# Altium schematic sheet Sheet1.SchDoc
size 431 x 279 mm; SheetNumber: 2; SheetTotal: 7; ENG_APP_DATE: --/--/--; DSN_APP_DATE: --/--/--; CHK_APP_DATE: --/--/--
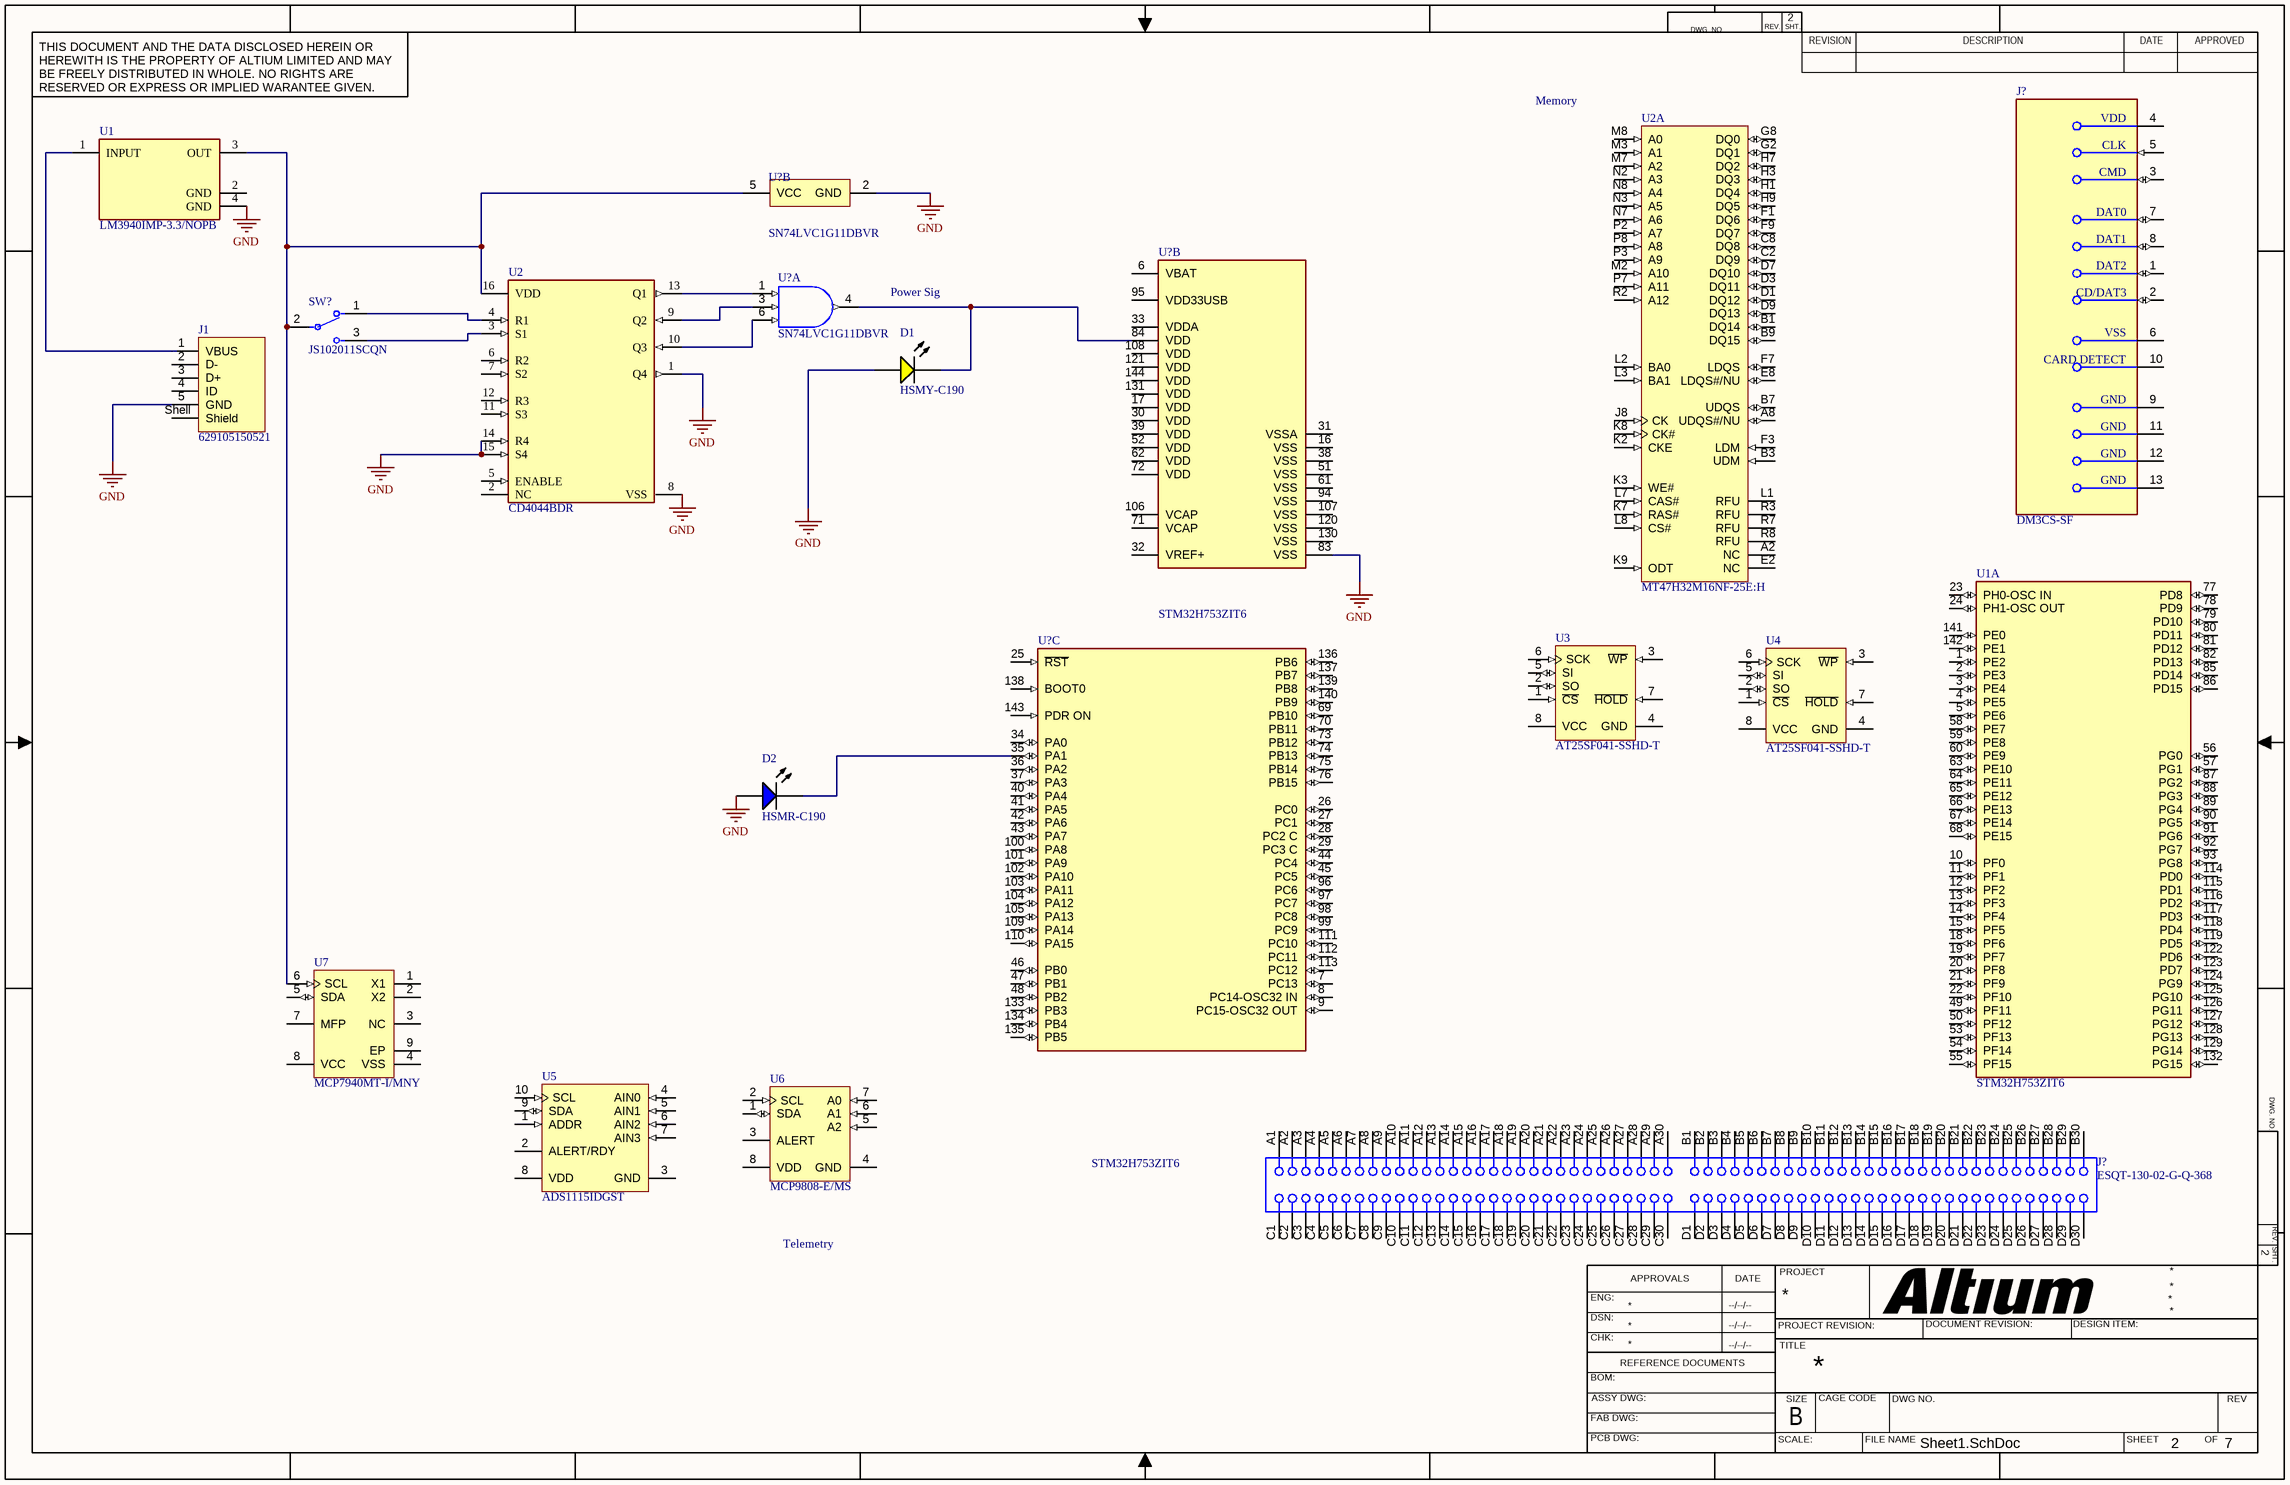
[diagram p0: Sheet1.SchDoc]

## Parts
(Parts that share a designator on the sheet are numbered #1, #2 ... from top to bottom, then left to right.)
D1  HSMY-C190  [AVAG-HSMX-C190_V]
D2  HSMR-C190  [AVAG-HSMX-C190_V]
J1  629105150521  [629105150521]
J?#1  DM3CS-SF  [FP-DM3CS-SF-MFG]
J?#2  ESQT-130-02-G-Q-368  [BTB2-V120F-04]
SW?  JS102011SCQN  [FP-JS102011SCQN-MFG]
U1#1  LM3940IMP-3.3/NOPB  [FP-DCY0004A-MFG]
U1#2  STM32H753ZIT6  [FP-LQFP144-1A-MFG]  (part A of 3)
U2#1  MT47H32M16NF-25E:H  [MICT-NF-84]  (part A of 2)
U2#2  CD4044BDR  [FP-D0016A-IPC_C]
U3  AT25SF041-SSHD-T  [ADST-SOIC-8_L]
U4  AT25SF041-SSHD-T  [ADST-SOIC-8_L]
U5  ADS1115IDGST  [TI-DGS10_M]
U6  MCP9808-E/MS  [MCHP-MSOP-MS8_L]
U7  MCP7940MT-I/MNY  [MCHP-TDFN-MNY8_V]
U?#1  SN74LVC1G11DBVR  [DBV0006A_N]  (part B of 2)
U?#2  STM32H753ZIT6  [FP-LQFP144-1A-MFG]  (part B of 3)
U?#3  SN74LVC1G11DBVR  [DBV0006A_N]  (part A of 2)
U?#4  STM32H753ZIT6  [FP-LQFP144-1A-MFG]  (part C of 3)

## Nets
GND: D1.1(A) D2.1(A) J1.5(GND) U1#1.4(GND) U2#2.1(Q4) U2#2.8(VSS) U2#2.14(R4) U2#2.15(S4) U?#1.2(GND) U?#2.83(VSS)
NetD1_2: D1.2(K) U?#2.84(VDD) U?#3.4(Y)
NetD2_2: D2.2(K) U?#4.35(PA1)
NetJ1_1: J1.1(VBUS) U1#1.1(INPUT)
NetSW?_1: SW?.1 U2#2.4(R1)
NetSW?_2: SW?.2(C) U1#1.3(OUT) U2#2.16(VDD) U7.6(SCL) U?#1.5(VCC)
NetSW?_3: SW?.3 U2#2.3(S1)
NetU2#2_9: U2#2.9(Q2) U?#3.3(B)
NetU2#2_10: U2#2.10(Q3) U?#3.6(C)
NetU2#2_13: U2#2.13(Q1) U?#3.1(A)

Not connected (* = marked no-connect by the designer): J1 2(D-) 3(D+) 4(ID) Shell(Shield); J?#1 1(DAT2) 2(CD/DAT3) 3(CMD) 4(VDD) 5(CLK) 6(VSS) 7(DAT0) 8(DAT1) 9(GND) 10(CARD_DETECT) 11(GND) 12(GND) 13(GND); J?#2 A1 A2 A3 A4 A5 A6 A7 A8 A9 A10 A11 A12 A13 A14 A15 A16 A17 A18 A19 A20 A21 A22 A23 A24 A25 A26 A27 A28 A29 A30 B1 B2 B3 B4 B5 B6 B7 B8 B9 B10 B11 B12 B13 B14 B15 B16 B17 B18 B19 B20 B21 B22 B23 B24 B25 B26 B27 B28 B29 B30 C1 C2 C3 C4 C5 C6 C7 C8 C9 C10 C11 C12 C13 C14 C15 C16 C17 C18 C19 C20 C21 C22 C23 C24 C25 C26 C27 C28 C29 C30 D1 D2 D3 D4 D5 D6 D7 D8 D9 D10 D11 D12 D13 D14 D15 D16 D17 D18 D19 D20 D21 D22 D23 D24 D25 D26 D27 D28 D29 D30; U1#1 2(GND); U1#2 1(PE2) 2(PE3) 3(PE4) 4(PE5) 5(PE6) 10(PF0) 11(PF1) 12(PF2) 13(PF3) 14(PF4) 15(PF5) 18(PF6) 19(PF7) 20(PF8) 21(PF9) 22(PF10) 23(PH0-OSC_IN) 24(PH1-OSC_OUT) 49(PF11) 50(PF12) 53(PF13) 54(PF14) 55(PF15) 56(PG0) 57(PG1) 58(PE7) 59(PE8) 60(PE9) 63(PE10) 64(PE11) 65(PE12) 66(PE13) 67(PE14) 68(PE15) 77(PD8) 78(PD9) 79(PD10) 80(PD11) 81(PD12) 82(PD13) 85(PD14) 86(PD15) 87(PG2) 88(PG3) 89(PG4) 90(PG5) 91(PG6) 92(PG7) 93(PG8) 114(PD0) 115(PD1) 116(PD2) 117(PD3) 118(PD4) 119(PD5) 122(PD6) 123(PD7) 124(PG9) 125(PG10) 126(PG11) 127(PG12) 128(PG13) 129(PG14) 132(PG15) 141(PE0) 142(PE1); U2#1 A2(NC) A8(UDQS#/NU) B1(DQ14) B3(UDM) B7(UDQS) B9(DQ15) C2(DQ9) C8(DQ8) D1(DQ12) D3(DQ11) D7(DQ10) D9(DQ13) E2(NC) E8(LDQS#/NU) F1(DQ6) F3(LDM) F7(LDQS) F9(DQ7) G2(DQ1) G8(DQ0) H1(DQ4) H3(DQ3) H7(DQ2) H9(DQ5) J8(CK) K2(CKE) K3(WE#) K7(RAS#) K8(CK#) K9(ODT) L1(RFU) L2(BA0) L3(BA1) L7(CAS#) L8(CS#) M2(A10) M3(A1) M7(A2) M8(A0) N2(A3) N3(A5) N7(A6) N8(A4) P2(A7) P3(A9) P7(A11) P8(A8) R2(A12) R3(RFU) R7(RFU) R8(RFU); U2#2 2(NC) 5(ENABLE) 6(R2) 7(S2) 11(S3) 12(R3); U3 1(~{CS}) 2(SO) 3(~{WP}) 4(GND) 5(SI) 6(SCK) 7(~{HOLD}) 8(VCC); U4 1(~{CS}) 2(SO) 3(~{WP}) 4(GND) 5(SI) 6(SCK) 7(~{HOLD}) 8(VCC); U5 1(ADDR) 2(ALERT/RDY) 3(GND) 4(AIN0) 5(AIN1) 6(AIN2) 7(AIN3) 8(VDD) 9(SDA) 10(SCL); U6 1(SDA) 2(SCL) 3(ALERT) 4(GND) 5(A2) 6(A1) 7(A0) 8(VDD); U7 1(X1) 2(X2) 3(NC) 4(VSS) 5(SDA) 7(MFP) 8(VCC) 9(EP); U?#2 6(VBAT) 16(VSS) 17(VDD) 30(VDD) 31(VSSA) 32(VREF+) 33(VDDA) 38(VSS) 39(VDD) 51(VSS) 52(VDD) 61(VSS) 62(VDD) 71(VCAP) 72(VDD) 94(VSS) 95(VDD33USB) 106(VCAP) 107(VSS) 108(VDD) 120(VSS) 121(VDD) 130(VSS) 131(VDD) 144(VDD); U?#4 7(PC13) 8(PC14-OSC32_IN) 9(PC15-OSC32_OUT) 25(~{RST}) 26(PC0) 27(PC1) 28(PC2_C) 29(PC3_C) 34(PA0) 36(PA2) 37(PA3) 40(PA4) 41(PA5) 42(PA6) 43(PA7) 44(PC4) 45(PC5) 46(PB0) 47(PB1) 48(PB2) 69(PB10) 70(PB11) 73(PB12) 74(PB13) 75(PB14) 76(PB15) 96(PC6) 97(PC7) 98(PC8) 99(PC9) 100(PA8) 101(PA9) 102(PA10) 103(PA11) 104(PA12) 105(PA13) 109(PA14) 110(PA15) 111(PC10) 112(PC11) 113(PC12) 133(PB3) 134(PB4) 135(PB5) 136(PB6) 137(PB7) 138(BOOT0) 139(PB8) 140(PB9) 143(PDR_ON)

## Notes on the sheet
- Memory
- Power Sig
- Telemetry
- DWG. NO.
- REV.
- SHT.
- THIS DOCUMENT AND THE DATA DISCLOSED HEREIN OR HEREWITH IS THE PROPERTY OF ALTIUM LIMITED AND MAY BE FREELY DISTRIBUTED IN WHOLE. NO RIGHTS ARE RESERVED OR EXPRESS OR IMPLIED WARANTEE GIVEN.
- REVISION
- DESCRIPTION
- DATE
- APPROVED
- ENG:
- APPROVALS
- PROJECT
- DSN:
- CHK:
- REFERENCE DOCUMENTS
- PROJECT REVISION:
- TITLE
- DOCUMENT REVISION:
- DESIGN ITEM:
- BOM:
- FAB DWG:
- PCB DWG:
- ASSY DWG:
- SCALE:
- SIZE
- B
- CAGE CODE
- FILE NAME
- DWG NO.
- SHEET
- OF
- REV

## Library data of the parts
D1 = CMP-1744-00003-1: LED Uni-Color Yellow, 65 mW, 20 mA, -40 to 85 degC, 2-Pin SMD, RoHS, Tape and Reel; Tolerance: 1%; Voltage Rating: 50 V; Power Rating: 100 mW; Case\Package: 0603; Resistance: 390 Ohm; Min Operating Temperature: -55 degC; Length: 1.6 mm; ComponentLink3Description: Package Specification; Mount: Surface Mount; PackageReference: HSMX-C190; ComponentLink2Description: Datasheet; DatasheetVersion: Mar-12; Case Code (Metric): 1608; Pins: 2; Package Quantity: 5000; ComponentLink2URL: http://docs.avagotech.com/docs/AV02-0551EN; ComponentLink1Description: Manufacturer URL; RoHSCompliant: true; Packaging: Tape and Reel; PackageDescription: 2-Pin Surface Mount Device, Body 1.6 x 0.8 mm, Height 0.9 mm; REACH SVHC: No SVHC; ComponentLink3URL: http://www.fairchildsemi.com/dwg/MA/MA03D.pdf; Voltage Rating (DC): 50 V; Width: 0.8 mm; ComponentLink1URL: http://www.avagotech.com/; Max Operating Temperature: 155 degC; Case Code (Imperial): 0603; Height: 0.45 mm
D2 = CMP-1744-00007-1: LED Uni-Color Blue, 78 mW, 20 mA, -40 to 85 degC, 2-Pin SMD, RoHS, Tape and Reel; Rds On Max: 10 Ohm; Nominal Vgs: -1.7 V; Max Power Dissipation: 360 mW; Elements: 1; Case\Package: TO-236-3; Input Capacitance: 73 pF; Typical Rise Time: 6.3 ns; Nominal Dual Supply Voltage: -50 V; Packaging: Tape and Reel; Height: 0.93 mm; Mount: Surface Mount; RoHSCompliant: true; DatasheetVersion: Apr-10; REACH SVHC: No SVHC; ComponentLink1URL: http://www.avagotech.com/; Radiation Hardening: No; ComponentLink3Description: Package Specification; ComponentLink3URL: http://www.fairchildsemi.com/dwg/MA/MA03D.pdf; ComponentLink2Description: Datasheet; PackageDescription: 2-Pin Surface Mount Device, Body 1.6 x 0.8 mm, Height 0.9 mm; Package Quantity: 3000; PackageReference: HSMX-C190; ComponentLink1Description: Manufacturer URL; Pins: 3; Length: 2.92 mm; ComponentLink2URL: http://docs.avagotech.com/docs/AV02-0977EN; Min Operating Temperature: -55 degC; Width: 1.3 mm; Max Operating Temperature: 150 degC
J1 = CMP-1502-03252-3: NexarPartId: 52645113; Number of Contacts: 5; Contact Resistance: 30mΩ; Connector Type: USB; Voltage Rating: 30V; Current Rating: 3A; USB Standard: USB 2.0; Gender: Receptacle; Insulation Resistance: 1GΩ; Height: 2.86mm; REACH SVHC: Unknown; RoHS: Compliant; Features: Shielded; Termination: SMD/SMT; Number of Pins: 5; Contact Plating: Gold; Packaging: Tape and Reel; Contact Material: Gold; Mount: Horizontal, Surface Mount; Max Operating Temperature: 85°C; Lead Free: Lead Free; Min Operating Temperature: -40°C; Orientation: Horizontal; Operating Supply Voltage: 30V
J?#1 = CMP-11597-000003-1: CONN MICRO SD CARD HINGED TYPE; Pitch: 1.1mm; Connector Type: Connector; Current Rating: 500mA; Voltage Rating (AC): 125V; Gender: Female; Insulation Resistance: 1GR; Number of Positions: 8; Contact Resistance: 100mR; Packaging: Tape and Reel; Flammability Rating: UL94 V-0; Lead Free: Lead Free; Min Operating Temperature: -25°C; Orientation: Right Angle; Width: 13.8mm; Number of Rows: 1; Housing Material: Polymer; Package Quantity: 1; Mount: Surface Mount; Max Current Rating: 500mA; Radiation Hardening: No; Max Operating Temperature: 85°C; Contact Plating: Gold; Depth: 1.83mm; Contact Material: Gold; Length: 14.1mm; Number of Contacts: 8; Termination: Solder
J?#2 = CMP-0001-00103-1: Board-to-Board Connector, PCI104, Self-Nesting Socket, Stackthrough, Vertical, 4-Row, Pitch 2mm, 120-Position, Stack 15.24mm, Receptacle; Component Kind: Standard; ClassName: Board Template Connector; Package Reference: BTB2-V120F-04; Publisher: Altium
SW? = CMP-10038-000023-1: SWITCH SLIDE SPDT 300MA 6V; Electrical Life: 5000Cycles; Actuator Type: Standard; Contact Resistance: 70mR; Actuator Material: Nylon; Max Voltage Rating (DC): 30V; Actuator Length: 2mm; Switch Function: On-On; Actuator Color: Black; Radiation Hardening: No; Throw Configuration: SPDT; Depth: 7.5mm; Case/Package: SMD/SMT; Package Quantity: 4000; Min Operating Temperature: -40°C; Length: 8.5mm; Current Rating: 300mA; Mount: Surface Mount; Voltage Rating (DC): 6V; RoHS Compliant: Yes; Orientation: Straight; Housing Material: Nylon; Contact Plating: Silver; Max Operating Temperature: 85°C; Packaging: Tape and Reel; Switch Travel: 2mm; Max Current Rating: 300mA; Contact Material: Copper Alloy; Series: JS; Termination: Gull Wing
U1#1 = CMP-0062-01788-4: IC REG LINEAR 3.3V 1A SOT223-4; Min Input Voltage: 4.5V; Max Supply Voltage: 7.5V; Number of Outputs: 1; Output Type: Fixed; Polarity: Positive; Dropout Voltage: 500mV; Quiescent Current: 15mA; Max Output Voltage: 3.3V; Length: 6.5mm; Termination: SMD/SMT; Width: 3.56mm; Min Supply Voltage: 4.5V; Max Output Current: 1A; Case/Package: SOT-223; Output Voltage: 3.3V; Current Rating: 1A; Packaging: Tape and Reel; Lead Free: Lead Free; Nominal Output Voltage: 3.3V; Height: 1.6mm; Series: -; Output Configuration: Positive; Radiation Hardening: No; Number of Regulators: 1; Package Quantity: 1000; REACH SVHC: No SVHC; Max Input Voltage: 7.5V; Max Operating Temperature: 125°C; Min Operating Temperature: -40°C; Output Current: 1A; Contact Plating: Tin; Number of Pins: 4; Mount: Surface Mount
U1#2 U?#2 U?#4 = CMP-12105-000009-1: LQFP 144 20X20X1.4 2; Manufacturer: STMicroelectronics; Number Of Pwm Channels: 24; Number Of I/Os: 114; Number Of Cores: 1; Min Supply Voltage: 1.62V; Interface: I2C,SPI,UART,USART,CAN,USB,LIN,IrDA,Ethernet,I2S,SMBus,Other; Standoff Height: 0.05mm; Number Of I2C Channels: 4; Max Junction Temp: +125°C; Memory Type: FLASH; Ram Size: 1MBytes; Number Of Spi Channels: 6; Core Architecture: ARM Cortex-M7; Number Of Uart Channels: 9; Memory Size: 2MBytes; Number Of Adc Channels: 36; Frequency: 480MHz; Data Bus Width: 32bits; Max Supply Voltage: 3.6V; Number Of Usb Channels: 2; Number Of A/D Converters: 3; Number Of Timers/Counters: 20; Temperature Range High: +125°C; Automotive: No; Mouser Description: MCU 32-Bit STM32 ARM Cortex M7 RISC 2MB Flash 1.8V/2.5V/3.3V 144-Pin LQFP Tray; Device Class L3: Microcontrollers; Height: 1.6mm; Octopart: https://octopart.com/stm32h753zit6-stmicroelectronics-87879771; Device Class L2: Embedded Processors and Controllers; Lead Free: Yes; Category: IC; ComponentLink2URL: https://www.st.com/resource/en/datasheet/stm32h753zi.pdf; Ambient Temperature Range High: +85°C; Number Of Ethernet Channels: 1; Device Class L1: Integrated Circuits (ICs); Ambient Temperature Range Low: -40°C; Package: LQFP144-1A; Temperature Range Low: -40°C; Digikey Description: LQFP 144 20X20X1.4 2; ComponentLink2Description: Datasheet; Temperature: -40°C to +125°C; Manufacturer Part Number: STM32H753ZIT6; RoHS: TRUE
U2#1 = CMP-2000-05228-1: 512 Mb DDR2-800 SDRAM, 32 Mb x 16, 2.5 ns, 1.8 V, 0 to 85 degC, 84-Ball FBGA, RoHS, Bulk; Manufacturer: Micron; Density: 512Mb; Number of I/O Lines: 16Bit; Maximum Clock Rate: 400MHz; Maximum Random Access Time: 0.4ns; Organization: 32Mx16; Screening Level: Commercial; Address Bus Width: 13Bit; Operating Supply Voltage: 1.8V; Lead Finish: Tin; Max Processing Temp: 260; Package Description: 84-Ball Ball Grid Array, Body 12.5 x 8 mm, Pitch 0.8 mm; Mounting: SurfaceMount; Datasheet URL: https://ciiva.com/datasheet-click-29613630?src=ciiva&sig=42c75271; Package Reference: NF84; Number of Bits per Word: 16Bit; Datasheet Version: Rev. W, 04/2014; Operating Temperature: 0to85C; Manufacturer URL: https://www.micron.com/; Type: DDR2SDRAM; Data Bus Width: 16Bit
U2#2 = CMP-04902-000018-1: IC QUAD NAND R/S LATCH 16SOIC; Polarity: Non-Inverting; Min Supply Voltage: 3V; Number of Output Lines: 4; Output Type: 3-STATE; Max Supply Voltage: 18V; Turn-On Delay Time: 50ns; Number of Elements: 1; Number of Input Lines: 8; Output Current: 6.8mA; High Level Output Current: -4.2mA; Low Level Output Current: 4.2mA; Quiescent Current: 20uA; Propagation Delay: 300ns; Mount: Surface Mount; Packaging: Tape and Reel; Weight: 0.004998oz; Contact Plating: Gold; Independent Circuits: 4; Number of Pins: 16; Number of Bits: 4; Max Operating Temperature: 125°C; Radiation Hardening: No; Case/Package: SOIC; Number of Circuits: 1; Technology: CMOS; Min Operating Temperature: -55°C; Package Quantity: 1; Lead Free: Lead Free; RoHS Compliant: Yes; Logic Function: Latch; Series: 4000B
U3 U4 = CMP-2000-07560-1: SPI Serial Flash Memory with Dual-I/O and Quad-I/O Support, 4 Mbits, 2.5 to 3.6 V, -40 to 85 degC, 8-Pin SOIC, RoHS, Tape and Reel; Manufacturer: Adesto; Frequency: 104MHz; Access Time: 8ns; Data Bus Width: 8b; Min Supply Voltage: 2.5V; Operating Supply Voltage: 3.3V; Package Version: Rev. G, 08/2014; Density: 4Mb; Page Size: 256B; Max Supply Voltage: 3.6V; Max Supply Current: 8mA; Number of Pins: 8; Memory Type: FLASH; Manufacturer URL: http://www.adestotech.com/; Max Frequency: 104MHz; Interface: Serial; Package Quantity: 4000; Weight: 0.019048oz; Mounting Technology: SurfaceMount; Min Operating Temperature: -40degC; Package Reference: SOIC-8; Max Operating Temperature: 85degC; Lead Free: LeadFree; Mount: SurfaceMount; Contact Plating: Gold; RoHSCompliant: True; Package Description: 8-Pin Small Outline Integrated Circuit, Body 4.925 x 3.9 mm, Pitch 1.27 mm; Case\/Package: SOIC; Datasheet URL: http://www.adestotech.com/wp-content/uploads/DS-AT25SF041_044.pdf; Datasheet Version: Rev. G, 08/2017; Memory Size: 4Mb; Packaging: TapeandReel
U5 = CMP-0003-00378-2: 16-Bit ADC with Integrated Multiplexer, PGA, Comparator, Oscillator, and Reference, -40 to 125 degC, 10-pin SOP (DGS10), Green (RoHS & no Sb/Br); Manufacturer: Texas Instruments; Sample Rate (max)(SPS): 860; SubFamily: Precision ADC (<=10MSPS); Architecture: Delta-Sigma; Digital Supply(Min)(V): 2; Resolution(Bits): 16; Digital Supply(Max)(V): 5.5; INL(Max)(+/-LSB): 1; Interface: Serial I2C; # Input Channels: 4; Eco-Plan: Green (RoHS & no Sb/Br); PackageDescription: 10-Pin Plastic Small Outline, Body 3 x 3 mm, Pitch 0.5 mm; Mounting Technology: Surface Mount; PackageReference: DGS10; DatasheetVersion: SBAS444B; ComponentLink3Description: Package Specification; ComponentLink1Description: Manufacturer URL; PartNumber: ADS1115IDGST; ComponentLink3URL: http://www.ti.com/lit/ml/mpds035b/mpds035b.pdf; ComponentLink2URL: http://www.ti.com/general/docs/lit/getliterature.tsp?genericPartNumber=ADS1115&fileType=pdf; Analog Voltage AV/DD(Min)(V): 2; ComponentLink2Description: Datasheet; PackageVersion: 4073272/C, 02/2004; Analog Voltage AV/DD(Max)(V): 5.5; Code_JEDEC: MO-153; ComponentLink1URL: http://www.ti.com/
U6 = CMP-0192-00344-1: + / - 0.5 degC Maximum Accuracy Digital Temperature Sensor, 400 uA, 2.7 to 5.5 V, -40 to 125 degC, 8-pin MSOP (MS8), Tube; Manufacturer: Microchip; ComponentLink3Description: Package Specification; ComponentLink4URL: http://www.microchip.com/MCP9808; PackageDescription: 8-Lead Plastic Micro Small Outline Package, 3 x 3 mm Body, 0.65 mm Pitch; ComponentLink2Description: Datasheet; PartNumber: MCP9808-E/MS; Mounting Technology: Surface Mount; ComponentLink4Description: Product URL; ComponentLink1Description: Manufacturer URL; ComponentLink2URL: http://ww1.microchip.com/downloads/en/DeviceDoc/25095A.pdf; ComponentLink3URL: http://www.microchip.com/stellent/groups/techpub_sg/documents/packagingspec/en012702.pdf; DatasheetVersion: Rev. A; ComponentLink1URL: http://www.microchip.com; PackageReference: MSOP-MS8; PackageVersion: C04-111C
U7 = CMP-0186-00324-1: Low-Cost I2C™ Real-Time Clock / Calendar with SRAM, 400 KHz Communications Speed, 64 Bytes SRAM, -40 to 85 degC, 8-pin TDFN (MNY8), Tape and Reel; Manufacturer: Microchip; ComponentLink2URL: http://ww1.microchip.com/downloads/en/DeviceDoc/22292A.pdf; ComponentLink3Description: Package Specification; Mounting Technology: Surface Mount; PackageVersion: C04-129C; ComponentLink4URL: http://www.microchip.com/MCP7940M; DatasheetVersion: Rev. A; PackageReference: TDFN-MNY8; PartNumber: MCP7940MT-I/MNY; ComponentLink4Description: Product URL; ComponentLink2Description: Datasheet; ComponentLink3URL: http://www.microchip.com/stellent/groups/techpub_sg/documents/packagingspec/en012702.pdf; PackageDescription: 8-Lead Plastic Dual Flat, 2 x 3 mm Body, 0.5 mm Pitch; ComponentLink1Description: Manufacturer URL; ComponentLink1URL: http://www.microchip.com
U?#1 U?#3 = CMP-0859-00236-3: Single 3-Input Positive-AND Gate, DBV0006A, LARGE T&R; Manufacturer: Texas Instruments; Output Type: CMOS; Voltage(Nom)(V): 1.8,2.5,3.3,5; ICC @ Nom Voltage(Max)(mA): 0.01; VCC(Min)(V): 1.65; Output Drive (IOL/IOH)(Max)(mA): 32/-32; Schmitt Trigger: No; Input Type: CMOS/TTL; VCC(Max)(V): 5.5; Gate Type: AND; Rating: Catalog; tpd @ Nom Voltage(Max)(ns): 20,7.8,6.2,4.6; Bits(#): 1; F @ Nom Voltage(Max)(Mhz): 150; Logic: True; Technology Family: LVC; Sub-Family: AND Gate; PackageReference: DBV0006A; Operating Temperature Range(C): -40 to 125,-40 to 85; DatasheetVersion: SCES487F; 3-State Output: No; Generic Part Number: SN74LVC1G11